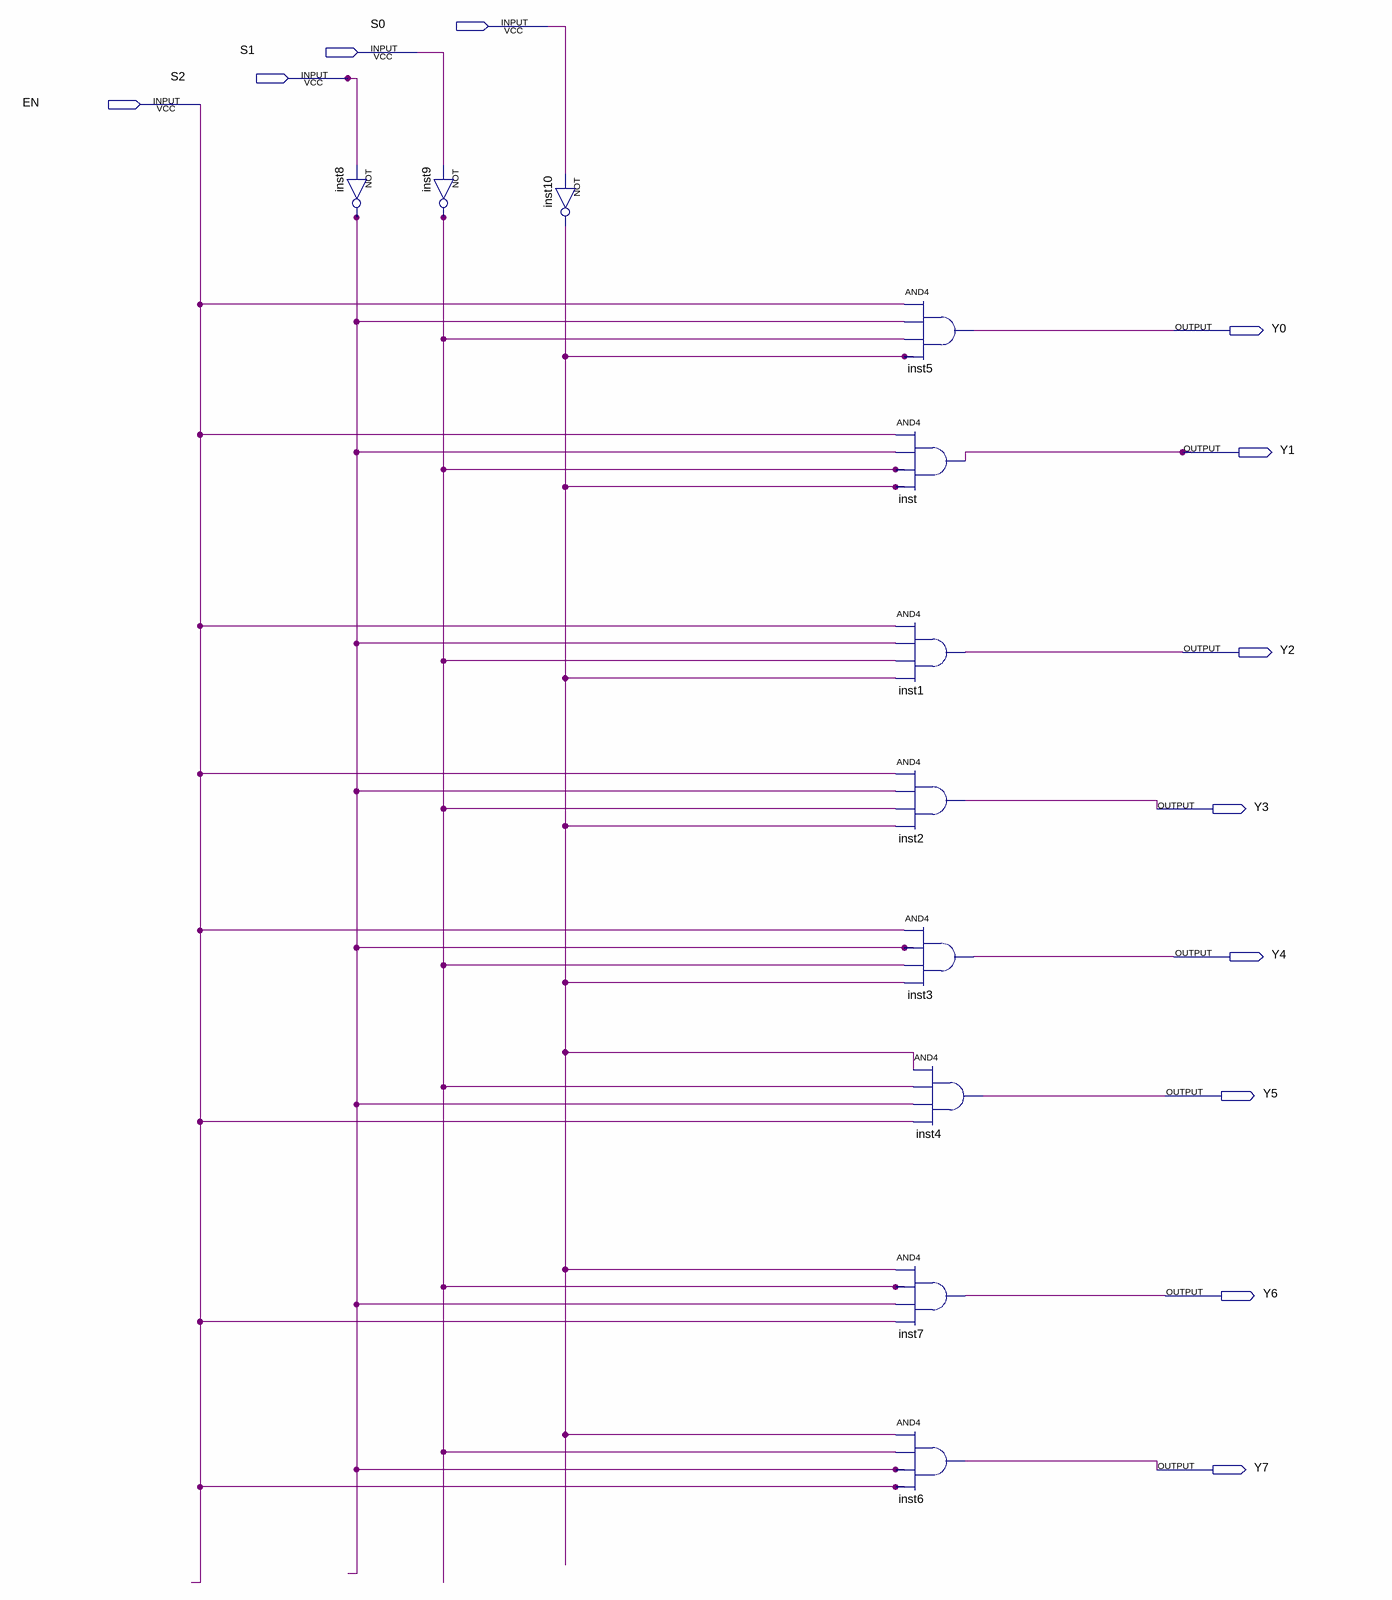
[diagram p0: schematic sheet]
// Quartus schematic decoder3to8.bdf as structural Verilog: 11 symbols, 12 pins
module decoder3to8 (
  input  S0,
  input  S1,
  input  S2,
  input  EN,
  output Y0,
  output Y1,
  output Y2,
  output Y3,
  output Y4,
  output Y5,
  output Y6,
  output Y7
);

  wire inst8_out, inst9_out, inst10_out;

  not inst8 (inst8_out, S2);
  not inst9 (inst9_out, S1);
  not inst10 (inst10_out, S0);
  and inst5 (Y0, EN, inst8_out, inst9_out, inst10_out);
  and inst (Y1, EN, inst8_out, inst9_out, inst10_out);
  and inst1 (Y2, EN, inst8_out, inst9_out, inst10_out);
  and inst2 (Y3, EN, inst8_out, inst9_out, inst10_out);
  and inst3 (Y4, EN, inst8_out, inst9_out, inst10_out);
  and inst4 (Y5, inst10_out, inst9_out, inst8_out, EN);
  and inst7 (Y6, inst10_out, inst9_out, inst8_out, EN);
  and inst6 (Y7, inst10_out, inst9_out, inst8_out, EN);
endmodule
